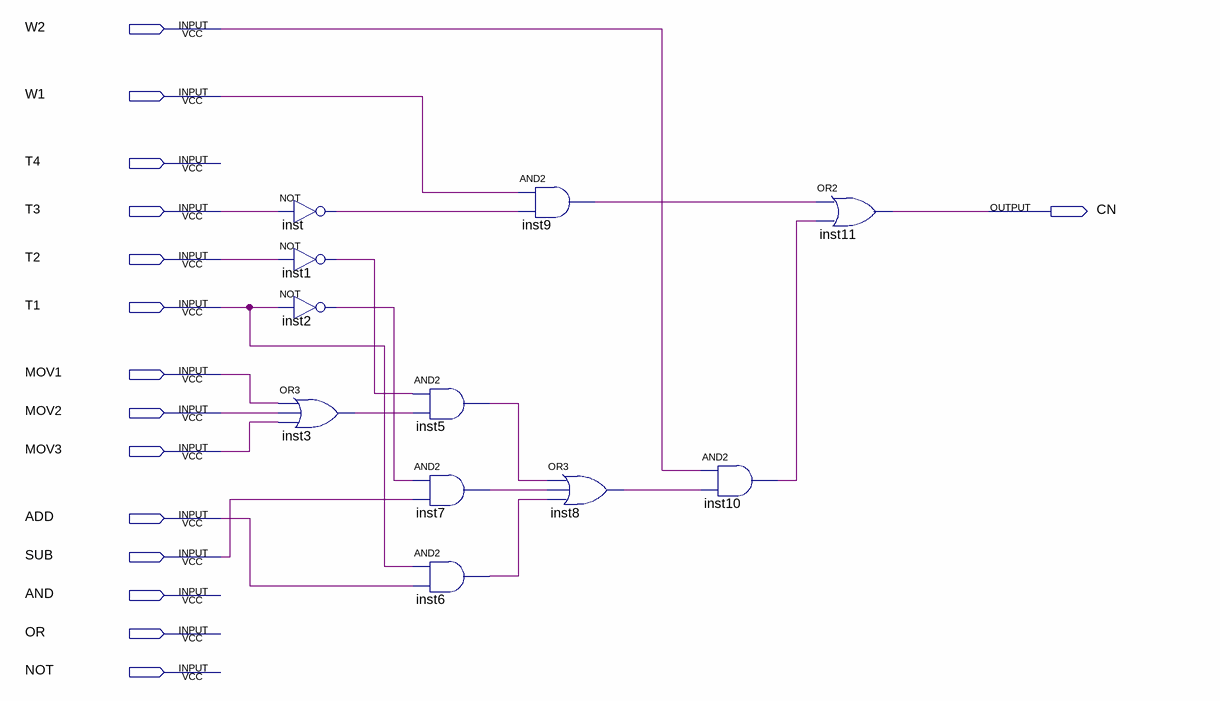
[diagram p0: schematic sheet]
// Quartus schematic CN.bdf as structural Verilog: 11 symbols, 15 pins
module CN (
  input  W2,
  input  W1,
  input  T4,
  input  T3,
  input  T2,
  input  T1,
  input  MOV1,
  input  MOV2,
  input  MOV3,
  input  ADD,
  input  SUB,
  input  AND,
  input  OR,
  input  NOT,
  output CN
);

  wire inst1_out, inst2_out, inst3_out, inst5_out, inst6_out, inst7_out, inst8_out, inst9_out, inst10_out,
       inst_out;

  not inst (inst_out, T3);
  not inst1 (inst1_out, T2);
  not inst2 (inst2_out, T1);
  or inst3 (inst3_out, MOV1, MOV2, MOV3);
  and inst5 (inst5_out, inst1_out, inst3_out);
  and inst7 (inst7_out, inst2_out, SUB);
  and inst6 (inst6_out, T1, ADD);
  and inst9 (inst9_out, W1, inst_out);
  or inst8 (inst8_out, inst5_out, inst7_out, inst6_out);
  and inst10 (inst10_out, W2, inst8_out);
  or inst11 (CN, inst9_out, inst10_out);
endmodule
